# EAGLE design board (EAGLE 9.4.2)

## Sheet 1 of 5
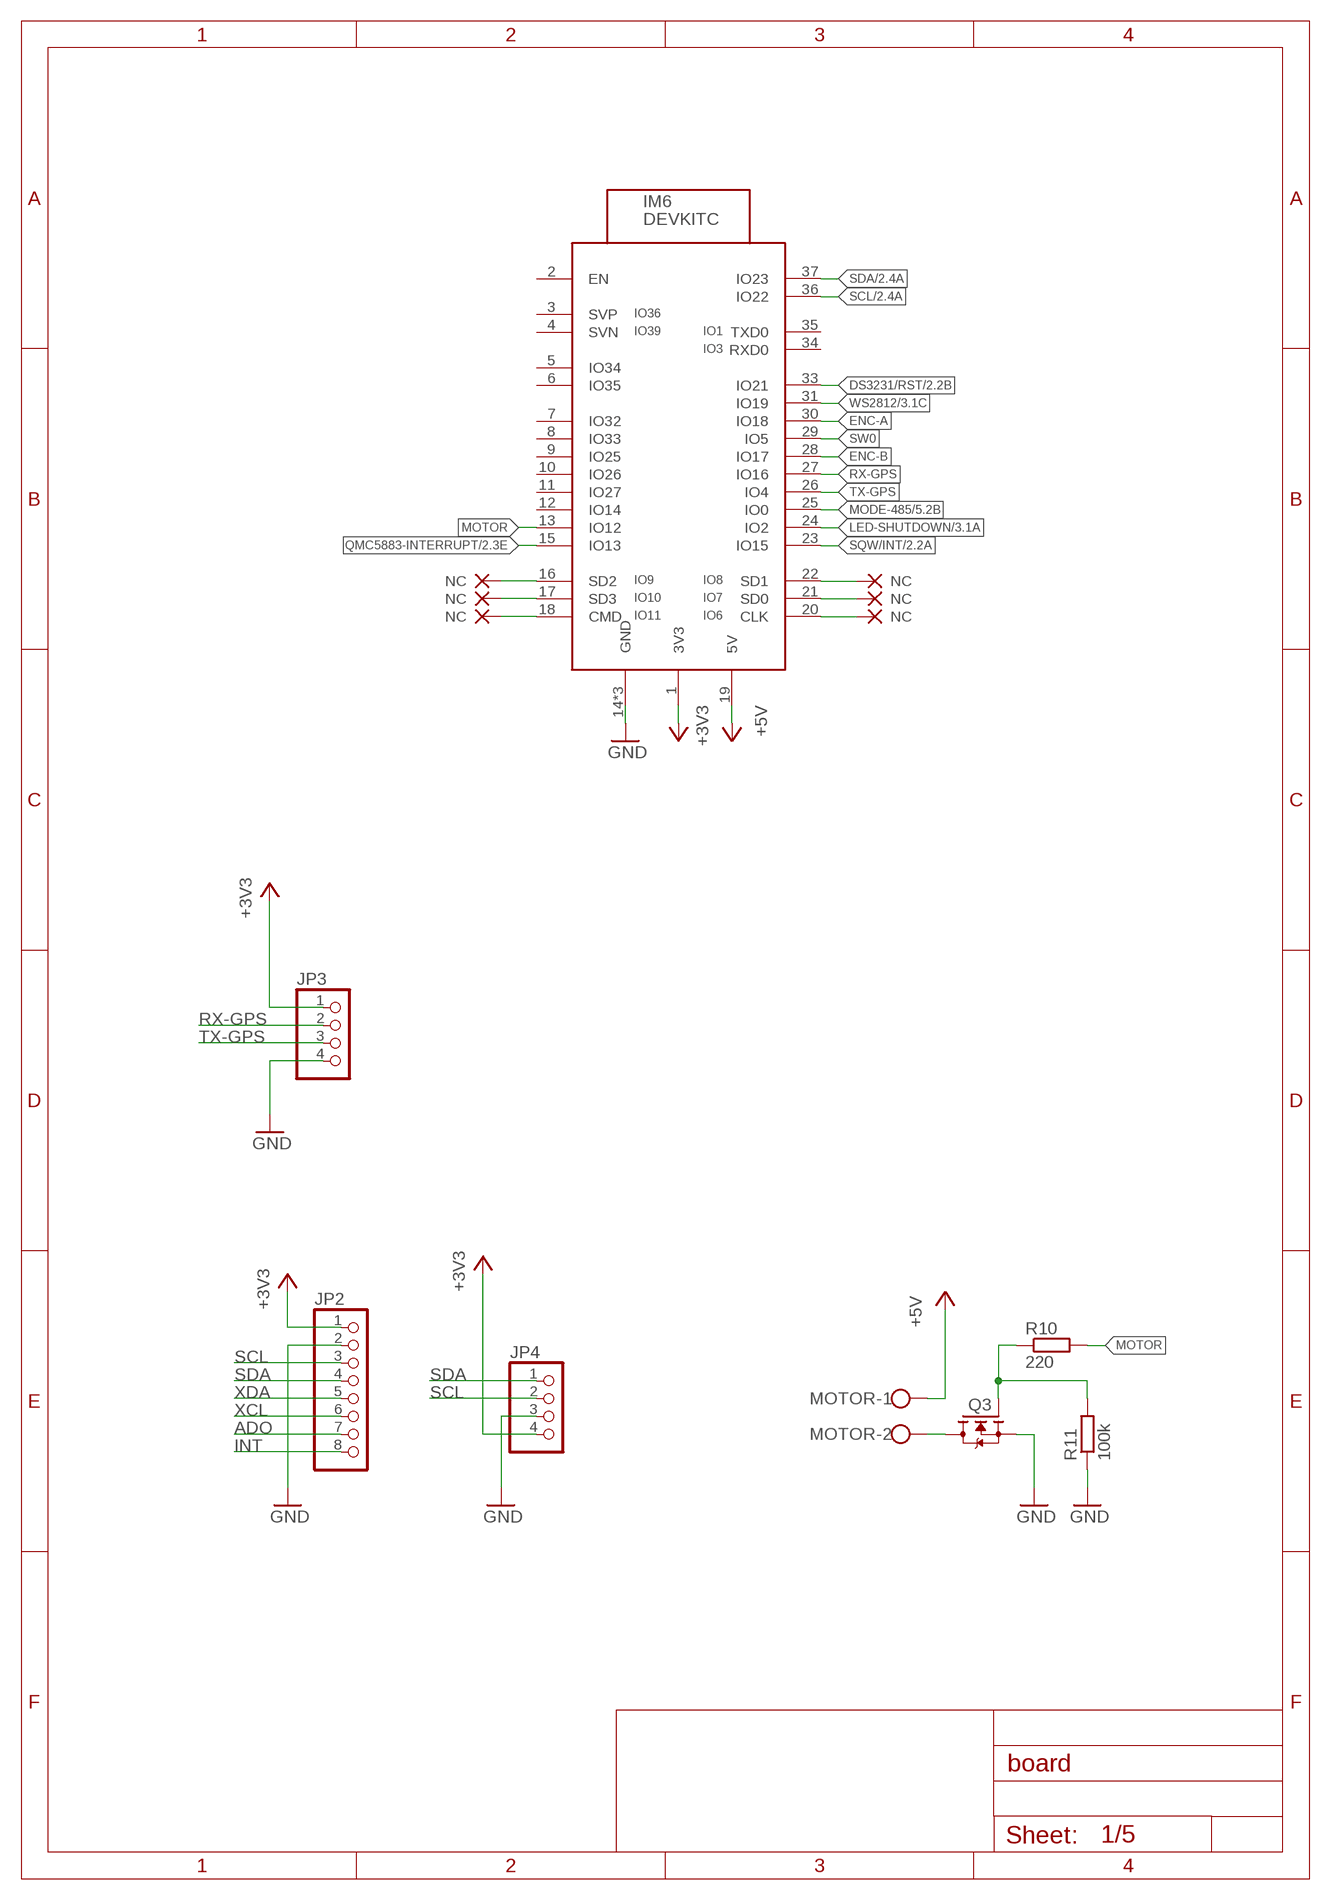
[diagram p0: schematic, sheet 1]

### Parts
IM6  DEVKITC  [DEVKITC]
JP2  PINHD-1X8  [1X08]
JP3  PINHD-1X4  [1X04]
JP4  PINHD-1X4  [1X04]
MOTOR  W237-102  [W237-102]
NC1  NC  (no package)
NC2  NC  (no package)
NC3  NC  (no package)
NC4  NC  (no package)
NC5  NC  (no package)
NC6  NC  (no package)
Q3  N-MOSFET-SO8  [SO-8]
R10  220  R-EU_R0402  [R0402]
R11  100k  R-EU_R0402  [R0402]

### Nets
+3V3: IM6.1(3V3) JP2.1 JP3.1 JP4.4 ; also sheet 2,3
+5V: MOTOR.1 ; also sheet 2,3,5
+5V_ESP: IM6.19(5V) ; supply symbol labelled +5V
ADO: JP2.7
DS3231/RST: IM6.33(IO21) ; also sheet 2
ENC-A: IM6.30(IO18) ; also sheet 2
ENC-B: IM6.28(IO17) ; also sheet 2
GND: IM6.14(GND) IM6.32(GND) IM6.38(GND) JP2.2 JP3.4 JP4.3 R11.1 ; also sheet 2,3,4,5
INT: JP2.8 ; also sheet 2
IO9_NC: IM6.16(SD2) NC1.NC
IO9_NC1: IM6.20(CLK) NC4.NC
IO10_NC: IM6.17(SD3) NC2.NC
IO10_NC1: IM6.21(SD0) NC5.NC
IO11_NC: IM6.18(CMD) NC3.NC
IO11_NC1: IM6.22(SD1) NC6.NC
LED-SHUTDOWN: IM6.24(IO2) ; also sheet 3
MODE-485: IM6.25(IO0) ; also sheet 5
MOTOR: IM6.13(IO12) R10.2
N$70: MOTOR.2 Q3.5(D) Q3.6(D) Q3.7(D) Q3.8(D)
N$71: Q3.4(G) R10.1 R11.2
N$74: Q3.1(S) Q3.2(S) Q3.3(S) ; supply symbol labelled GND
QMC5883-INTERRUPT: IM6.15(IO13) ; also sheet 2
RX-GPS: IM6.27(IO16) JP3.2
SCL: IM6.36(IO22) JP2.3 JP4.2 ; also sheet 2
SDA: IM6.37(IO23) JP2.4 JP4.1 ; also sheet 2
SQW/INT: IM6.23(IO15) ; also sheet 2
SW0: IM6.29(IO5) ; also sheet 2
TX-GPS: IM6.26(IO4) JP3.3
WS2812: IM6.31(IO19) ; also sheet 3
XCL: JP2.6
XDA: JP2.5
Unconnected: IM6.2(EN) IM6.3(SVP) IM6.4(SVN) IM6.5(IO34) IM6.6(IO35) IM6.7(IO32) IM6.8(IO33) IM6.9(IO25) IM6.10(IO26) IM6.11(IO27) IM6.12(IO14) IM6.34(RXD0) IM6.35(TXD0)

## Sheet 2 of 5
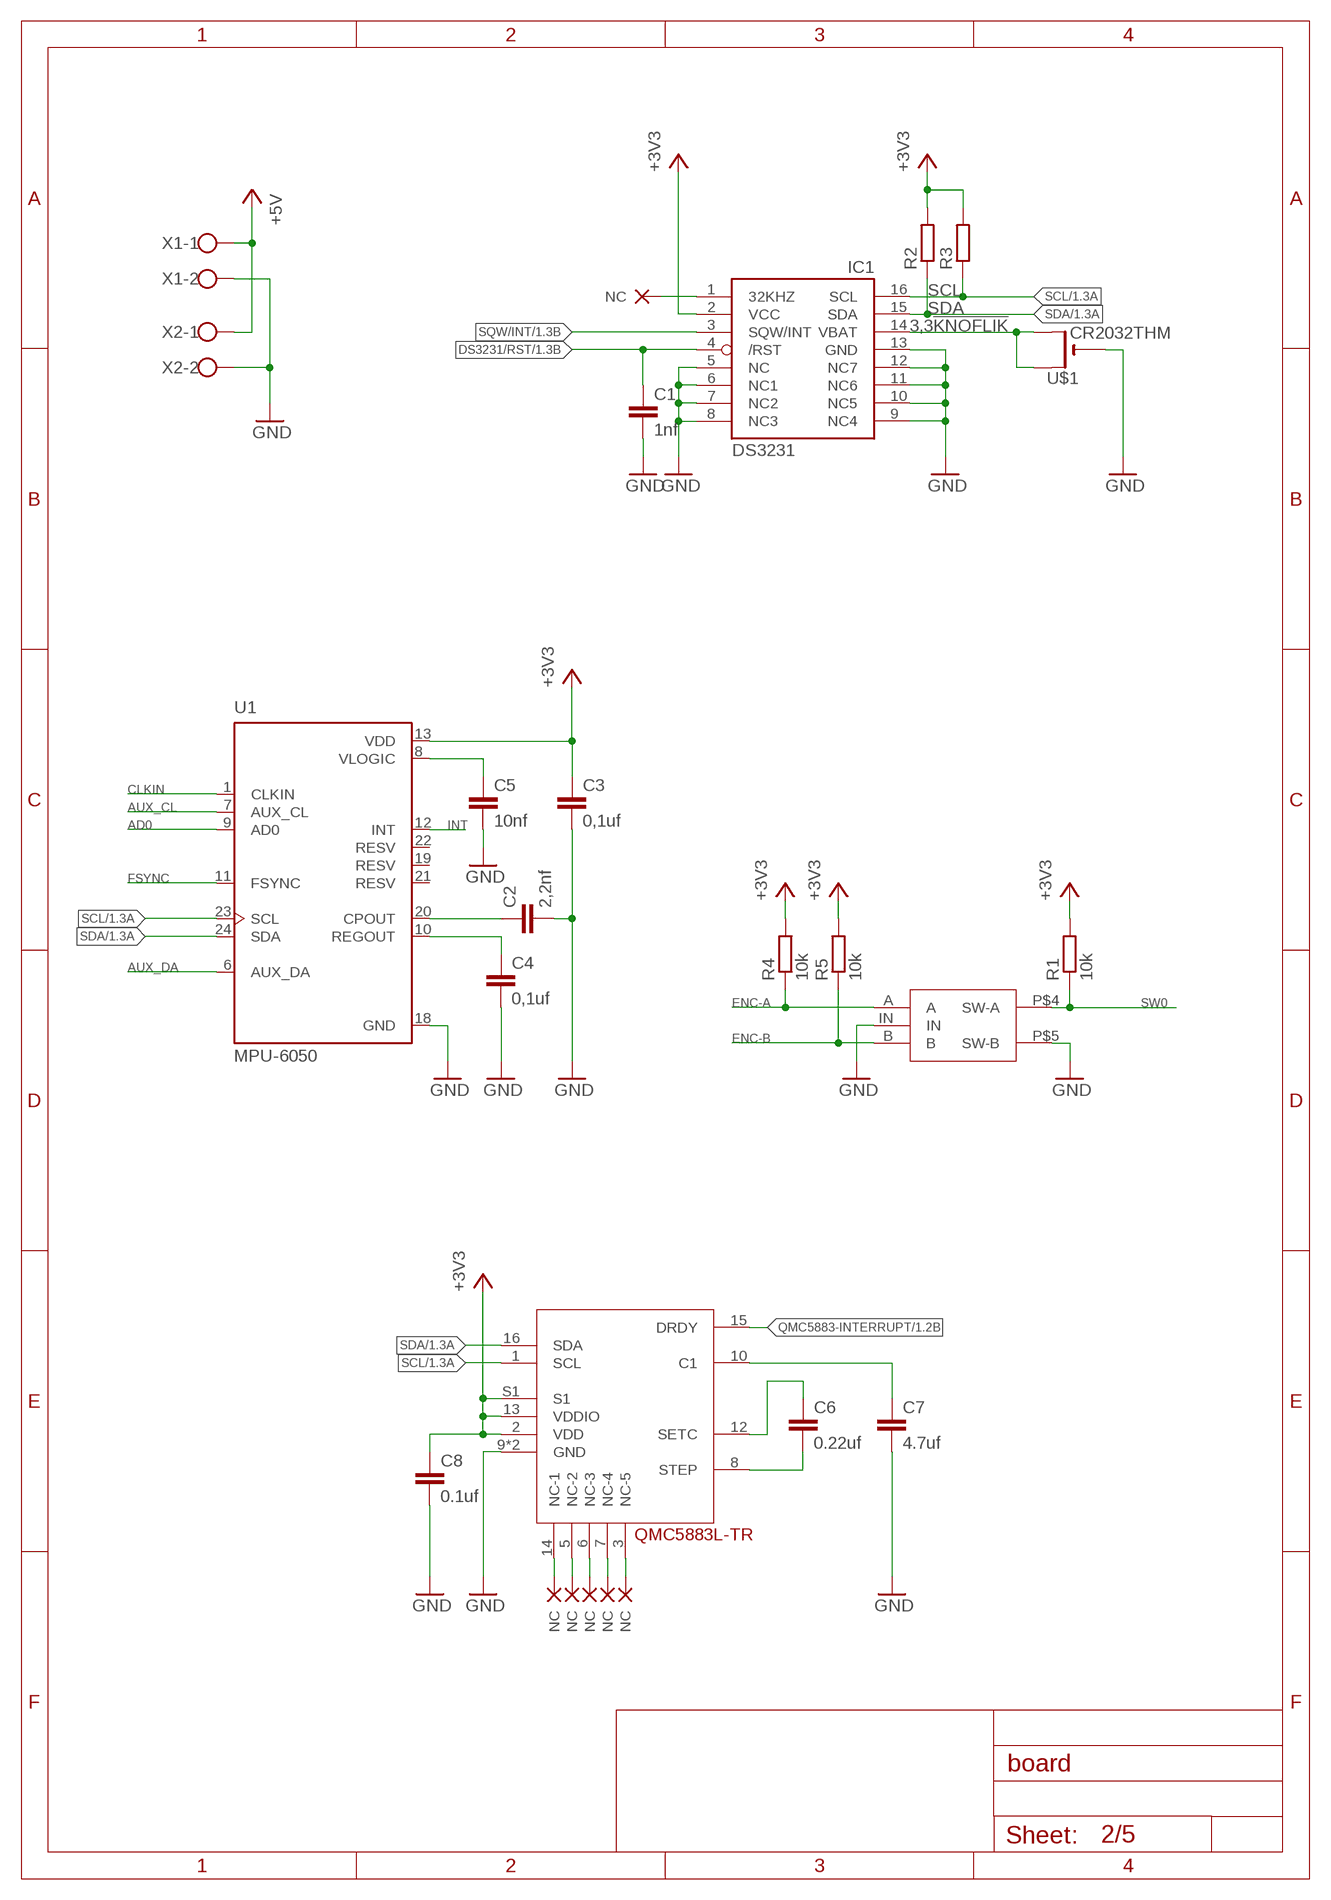
[diagram p1: schematic, sheet 2]

### Parts
C1  1nf  C-EUC0402K  [C0402K]
C2  2,2nf  C-EUC0402K  [C0402K]
C3  0,1uf  C-EUC0402K  [C0402K]
C4  0,1uf  C-EUC0402K  [C0402K]
C5  10nf  C-EUC0402K  [C0402K]
C6  0.22uf  C-EUC0402K  [C0402K]
C7  4.7uf  C-EUC0402K  [C0402K]
C8  0.1uf  C-EUC0402K  [C0402K]
IC1  DS3231/SO  [SO16W]
IC2  QMC5883L-TR  [QMC5882L-TR]
NC7  NC  (no package)
NC8  NC  (no package)
NC9  NC  (no package)
NC10  NC  (no package)
NC11  NC  (no package)
NC12  NC  (no package)
R1  10k  R-EU_R0402  [R0402]
R2  R-EU_R0603  [R0603]
R3  R-EU_R0603  [R0603]
R4  10k  R-EU_R0402  [R0402]
R5  10k  R-EU_R0402  [R0402]
U1  MPU-6050  [QFN50P400X400X95-24N]
U$1  CR2032THM  [CR2032-THRU]
U$62  EC11-1S  [EC11-1S]
X1  W237-102  [W237-102]
X2  W237-102  [W237-102]

### Nets
3,3!KNOFLIK: IC1.14(VBAT) U$1.+1(+) U$1.+2(+1)
+3V3: C3.1 C8.1 IC1.2(VCC) IC2.2(VDD) IC2.13(VDDIO) IC2.S1 R1.2 R2.2 R3.2 R4.2 R5.2 U1.13(VDD) ; also sheet 1,3
+5V: X1.1 X2.1 ; also sheet 1,3,5
AD0: U1.9(AD0)
AUX_CL: U1.7(AUX_CL)
AUX_DA: U1.6(AUX_DA)
CLKIN: U1.1(CLKIN)
DS3231/RST: C1.1 IC1.4(/RST) ; also sheet 1
ENC-A: R4.1 U$62.A ; also sheet 1
ENC-B: R5.1 U$62.B ; also sheet 1
FSYNC: U1.11(FSYNC)
GND: C1.2 C2.2 C3.2 C5.2 C7.2 C8.2 IC1.5(NC) IC1.6(NC1) IC1.7(NC2) IC1.8(NC3) IC1.9(NC4) IC1.10(NC5) IC1.11(NC6) IC1.12(NC7) IC1.13(GND) IC2.9(GND) IC2.11(GND) U1.18(GND) U$1.- U$62.IN U$62.P$5(SW-B) X1.2 X2.2 ; also sheet 1,3,4,5
INT: U1.12(INT) ; also sheet 1
IO9_NC2: IC2.14(NC-1) NC7.NC
IO9_NC3: IC2.7(NC-4) NC11.NC
IO10_NC2: IC2.5(NC-2) NC9.NC
IO10_NC3: IC2.3(NC-5) NC12.NC
IO11_NC2: IC2.6(NC-3) NC10.NC
IO11_NC3: IC1.1(32KHZ) NC8.NC
N$1: C2.1 U1.20(CPOUT)
N$3: C4.1 U1.10(REGOUT)
N$57: C4.2 ; supply symbol labelled GND
N$58: C5.1 U1.8(VLOGIC)
N$60: C6.1 IC2.12(SETC)
N$62: C6.2 IC2.8(STEP)
N$66: C7.1 IC2.10(C1)
QMC5883-INTERRUPT: IC2.15(DRDY) ; also sheet 1
SCL: IC1.16(SCL) IC2.1(SCL) R3.1 U1.23(SCL) ; also sheet 1
SDA: IC1.15(SDA) IC2.16(SDA) R2.1 U1.24(SDA) ; also sheet 1
SQW/INT: IC1.3(SQW/INT) ; also sheet 1
SW0: R1.1 U$62.P$4(SW-A) ; also sheet 1
Unconnected: U1.19(RESV) U1.21(RESV) U1.22(RESV)

## Sheet 3 of 5
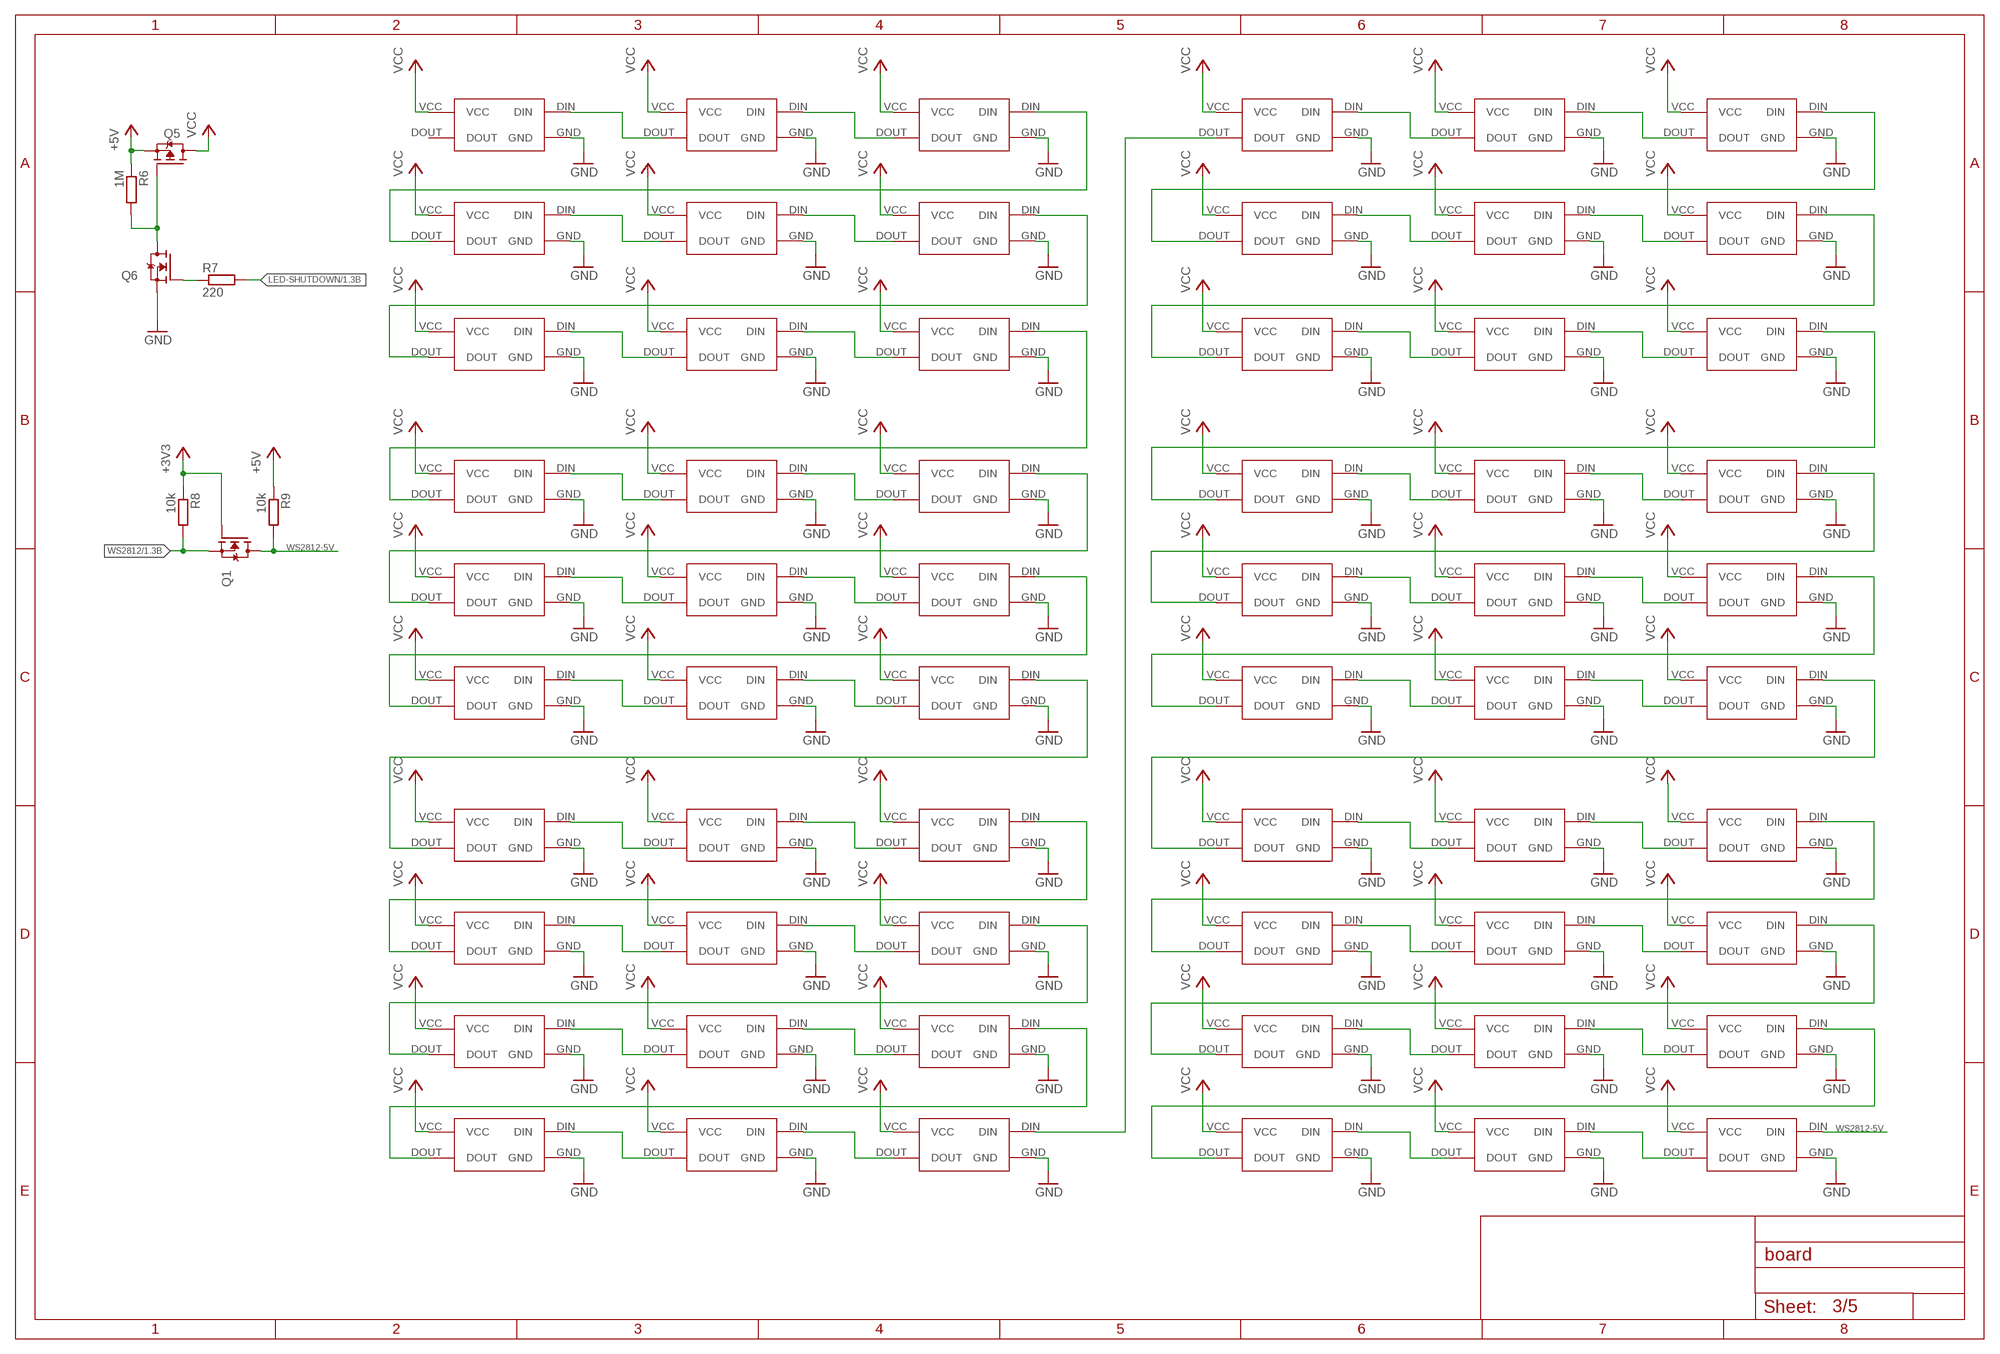
[diagram p2: schematic, sheet 3]

### Parts
Q1  N-MOSFET-SOT23-GSD  [SOT23]
Q5  P-MOSFET-MLP  [MLP3.3X3.3]
Q6  N-MOSFET-SOT23-GSD  [SOT23]
R6  1M  R-EU_R0402  [R0402]
R7  220  R-EU_R0603  [R0603]
R8  10k  R-EU_R0402  [R0402]
R9  10k  R-EU_R0402  [R0402]
U$2  WS2812  [WS2812B-MINI]
U$3  WS2812  [WS2812B-MINI]
U$4  WS2812  [WS2812B-MINI]
U$5  WS2812  [WS2812B-MINI]
U$6  WS2812  [WS2812B-MINI]
U$7  WS2812  [WS2812B-MINI]
U$8  WS2812  [WS2812B-MINI]
U$9  WS2812  [WS2812B-MINI]
U$10  WS2812  [WS2812B-MINI]
U$11  WS2812  [WS2812B-MINI]
U$12  WS2812  [WS2812B-MINI]
U$13  WS2812  [WS2812B-MINI]
U$14  WS2812  [WS2812B-MINI]
U$15  WS2812  [WS2812B-MINI]
U$16  WS2812  [WS2812B-MINI]
U$17  WS2812  [WS2812B-MINI]
U$18  WS2812  [WS2812B-MINI]
U$19  WS2812  [WS2812B-MINI]
U$20  WS2812  [WS2812B-MINI]
U$21  WS2812  [WS2812B-MINI]
U$22  WS2812  [WS2812B-MINI]
U$23  WS2812  [WS2812B-MINI]
U$24  WS2812  [WS2812B-MINI]
U$25  WS2812  [WS2812B-MINI]
U$26  WS2812  [WS2812B-MINI]
U$27  WS2812  [WS2812B-MINI]
U$28  WS2812  [WS2812B-MINI]
U$29  WS2812  [WS2812B-MINI]
U$30  WS2812  [WS2812B-MINI]
U$31  WS2812  [WS2812B-MINI]
U$32  WS2812  [WS2812B-MINI]
U$33  WS2812  [WS2812B-MINI]
U$34  WS2812  [WS2812B-MINI]
U$35  WS2812  [WS2812B-MINI]
U$36  WS2812  [WS2812B-MINI]
U$37  WS2812  [WS2812B-MINI]
U$38  WS2812  [WS2812B-MINI]
U$39  WS2812  [WS2812B-MINI]
U$40  WS2812  [WS2812B-MINI]
U$41  WS2812  [WS2812B-MINI]
U$42  WS2812  [WS2812B-MINI]
U$43  WS2812  [WS2812B-MINI]
U$44  WS2812  [WS2812B-MINI]
U$45  WS2812  [WS2812B-MINI]
U$46  WS2812  [WS2812B-MINI]
U$47  WS2812  [WS2812B-MINI]
U$48  WS2812  [WS2812B-MINI]
U$49  WS2812  [WS2812B-MINI]
U$50  WS2812  [WS2812B-MINI]
U$51  WS2812  [WS2812B-MINI]
U$52  WS2812  [WS2812B-MINI]
U$53  WS2812  [WS2812B-MINI]
U$54  WS2812  [WS2812B-MINI]
U$55  WS2812  [WS2812B-MINI]
U$56  WS2812  [WS2812B-MINI]
U$57  WS2812  [WS2812B-MINI]
U$58  WS2812  [WS2812B-MINI]
U$59  WS2812  [WS2812B-MINI]
U$60  WS2812  [WS2812B-MINI]
U$61  WS2812  [WS2812B-MINI]

### Nets
+3V3: Q1.1(G) R8.1 ; also sheet 1,2
+5V: Q5.1(S) Q5.2(S) Q5.3(S) R6.1 R9.1 ; also sheet 1,2,5
GND: Q6.2(S) U$2.GND U$3.GND U$4.GND U$5.GND U$6.GND U$7.GND U$8.GND U$9.GND U$10.GND U$11.GND U$12.GND U$13.GND U$14.GND U$15.GND U$16.GND U$17.GND U$18.GND U$19.GND U$20.GND U$21.GND U$22.GND U$23.GND U$24.GND U$25.GND U$26.GND U$27.GND U$28.GND U$29.GND U$30.GND U$31.GND U$32.GND U$33.GND U$34.GND U$35.GND U$36.GND U$37.GND U$38.GND U$39.GND U$40.GND U$41.GND U$42.GND U$43.GND U$44.GND U$45.GND U$46.GND U$47.GND U$48.GND U$49.GND U$50.GND U$51.GND U$52.GND U$53.GND U$54.GND U$55.GND U$56.GND U$57.GND U$58.GND U$59.GND U$60.GND U$61.GND ; also sheet 1,2,4,5
LED-SHUTDOWN: R7.2 ; also sheet 1
N$2: U$4.DIN U$5.DOUT
N$4: U$7.DIN U$8.DOUT
N$5: U$2.DIN U$3.DOUT
N$6: U$3.DIN U$4.DOUT
N$7: U$34.DIN U$35.DOUT
N$8: U$5.DIN U$6.DOUT
N$9: U$6.DIN U$7.DOUT
N$10: U$8.DIN U$9.DOUT
N$11: U$9.DIN U$10.DOUT
N$12: U$40.DIN U$41.DOUT
N$13: U$11.DIN U$12.DOUT
N$14: U$12.DIN U$13.DOUT
N$15: U$14.DIN U$15.DOUT
N$16: U$15.DIN U$16.DOUT
N$17: U$46.DIN U$47.DOUT
N$18: U$17.DIN U$18.DOUT
N$19: U$18.DIN U$19.DOUT
N$20: U$20.DIN U$21.DOUT
N$21: U$21.DIN U$22.DOUT
N$22: U$52.DIN U$53.DOUT
N$23: U$23.DIN U$24.DOUT
N$24: U$24.DIN U$25.DOUT
N$25: U$26.DIN U$27.DOUT
N$26: U$27.DIN U$28.DOUT
N$27: U$58.DIN U$59.DOUT
N$28: U$29.DIN U$30.DOUT
N$29: U$30.DIN U$31.DOUT
N$30: U$32.DIN U$33.DOUT
N$31: U$33.DIN U$34.DOUT
N$32: U$10.DIN U$11.DOUT
N$33: U$35.DIN U$36.DOUT
N$34: U$36.DIN U$37.DOUT
N$35: U$38.DIN U$39.DOUT
N$36: U$39.DIN U$40.DOUT
N$37: U$13.DIN U$14.DOUT
N$38: U$41.DIN U$42.DOUT
N$39: U$42.DIN U$43.DOUT
N$40: U$44.DIN U$45.DOUT
N$41: U$45.DIN U$46.DOUT
N$42: U$16.DIN U$17.DOUT
N$43: U$47.DIN U$48.DOUT
N$44: U$48.DIN U$49.DOUT
N$45: U$50.DIN U$51.DOUT
N$46: U$51.DIN U$52.DOUT
N$47: U$49.DIN U$50.DOUT
N$48: U$53.DIN U$54.DOUT
N$49: U$54.DIN U$55.DOUT
N$50: U$56.DIN U$57.DOUT
N$51: U$57.DIN U$58.DOUT
N$52: U$22.DIN U$23.DOUT
N$53: U$59.DIN U$60.DOUT
N$54: U$60.DIN U$61.DOUT
N$55: U$25.DIN U$26.DOUT
N$56: U$28.DIN U$29.DOUT
N$59: U$31.DIN U$32.DOUT
N$61: U$37.DIN U$38.DOUT
N$63: U$43.DIN U$44.DOUT
N$64: U$19.DIN U$20.DOUT
N$65: U$55.DIN U$56.DOUT
N$68: Q5.4(G) Q6.3(D) R6.2
N$69: Q6.1(G) R7.1
VCC: Q5.5(D) Q5.6(D) Q5.7(D) Q5.8(D) U$2.VCC U$3.VCC U$4.VCC U$5.VCC U$6.VCC U$7.VCC U$8.VCC U$9.VCC U$10.VCC U$11.VCC U$12.VCC U$13.VCC U$14.VCC U$15.VCC U$16.VCC U$17.VCC U$18.VCC U$19.VCC U$20.VCC U$21.VCC U$22.VCC U$23.VCC U$24.VCC U$25.VCC U$26.VCC U$27.VCC U$28.VCC U$29.VCC U$30.VCC U$31.VCC U$32.VCC U$33.VCC U$34.VCC U$35.VCC U$36.VCC U$37.VCC U$38.VCC U$39.VCC U$40.VCC U$41.VCC U$42.VCC U$43.VCC U$44.VCC U$45.VCC U$46.VCC U$47.VCC U$48.VCC U$49.VCC U$50.VCC U$51.VCC U$52.VCC U$53.VCC U$54.VCC U$55.VCC U$56.VCC U$57.VCC U$58.VCC U$59.VCC U$60.VCC U$61.VCC ; also sheet 4
WS2812: Q1.2(S) R8.2 ; also sheet 1
WS2812-5V: Q1.3(D) R9.2 U$61.DIN
Unconnected: U$2.DOUT

## Sheet 4 of 5
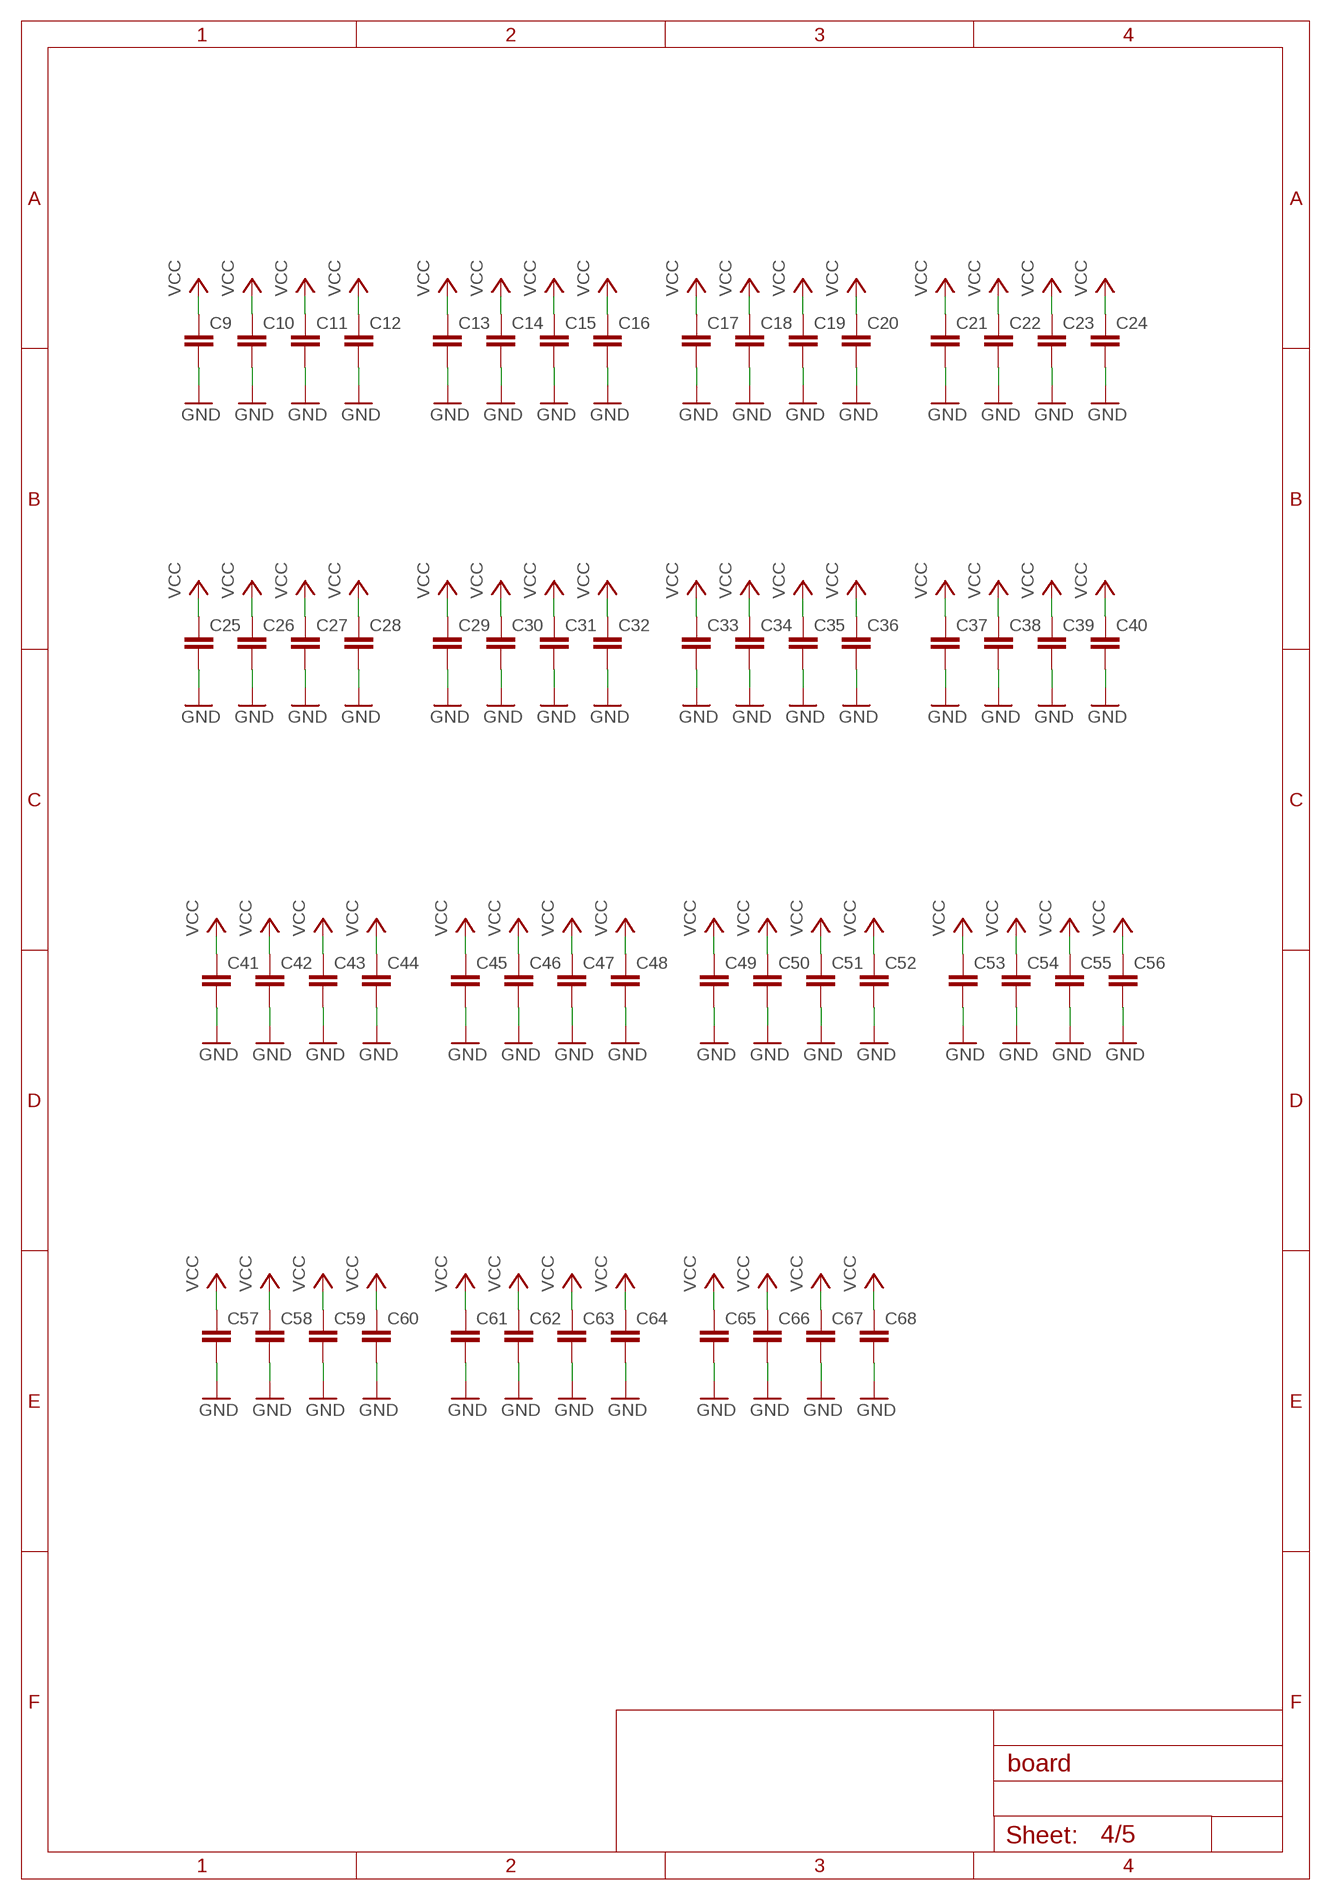
[diagram p3: schematic, sheet 4]

### Parts
C9  C-EUC0402K  [C0402K]
C10  C-EUC0402K  [C0402K]
C11  C-EUC0402K  [C0402K]
C12  C-EUC0402K  [C0402K]
C13  C-EUC0402K  [C0402K]
C14  C-EUC0402K  [C0402K]
C15  C-EUC0402K  [C0402K]
C16  C-EUC0402K  [C0402K]
C17  C-EUC0402K  [C0402K]
C18  C-EUC0402K  [C0402K]
C19  C-EUC0402K  [C0402K]
C20  C-EUC0402K  [C0402K]
C21  C-EUC0402K  [C0402K]
C22  C-EUC0402K  [C0402K]
C23  C-EUC0402K  [C0402K]
C24  C-EUC0402K  [C0402K]
C25  C-EUC0402K  [C0402K]
C26  C-EUC0402K  [C0402K]
C27  C-EUC0402K  [C0402K]
C28  C-EUC0402K  [C0402K]
C29  C-EUC0402K  [C0402K]
C30  C-EUC0402K  [C0402K]
C31  C-EUC0402K  [C0402K]
C32  C-EUC0402K  [C0402K]
C33  C-EUC0402K  [C0402K]
C34  C-EUC0402K  [C0402K]
C35  C-EUC0402K  [C0402K]
C36  C-EUC0402K  [C0402K]
C37  C-EUC0402K  [C0402K]
C38  C-EUC0402K  [C0402K]
C39  C-EUC0402K  [C0402K]
C40  C-EUC0402K  [C0402K]
C41  C-EUC0402K  [C0402K]
C42  C-EUC0402K  [C0402K]
C43  C-EUC0402K  [C0402K]
C44  C-EUC0402K  [C0402K]
C45  C-EUC0402K  [C0402K]
C46  C-EUC0402K  [C0402K]
C47  C-EUC0402K  [C0402K]
C48  C-EUC0402K  [C0402K]
C49  C-EUC0402K  [C0402K]
C50  C-EUC0402K  [C0402K]
C51  C-EUC0402K  [C0402K]
C52  C-EUC0402K  [C0402K]
C53  C-EUC0402K  [C0402K]
C54  C-EUC0402K  [C0402K]
C55  C-EUC0402K  [C0402K]
C56  C-EUC0402K  [C0402K]
C57  C-EUC0402K  [C0402K]
C58  C-EUC0402K  [C0402K]
C59  C-EUC0402K  [C0402K]
C60  C-EUC0402K  [C0402K]
C61  C-EUC0402K  [C0402K]
C62  C-EUC0402K  [C0402K]
C63  C-EUC0402K  [C0402K]
C64  C-EUC0402K  [C0402K]
C65  C-EUC0402K  [C0402K]
C66  C-EUC0402K  [C0402K]
C67  C-EUC0402K  [C0402K]
C68  C-EUC0402K  [C0402K]

### Nets
GND: C9.2 C10.2 C11.2 C12.2 C13.2 C14.2 C15.2 C16.2 C17.2 C18.2 C19.2 C20.2 C21.2 C22.2 C23.2 C24.2 C25.2 C26.2 C27.2 C28.2 C29.2 C30.2 C31.2 C32.2 C33.2 C34.2 C35.2 C36.2 C37.2 C38.2 C39.2 C40.2 C41.2 C42.2 C43.2 C44.2 C45.2 C46.2 C47.2 C48.2 C49.2 C50.2 C51.2 C52.2 C53.2 C54.2 C55.2 C56.2 C57.2 C58.2 C59.2 C60.2 C61.2 C62.2 C63.2 C64.2 C65.2 C66.2 C67.2 C68.2 ; also sheet 1,2,3,5
VCC: C9.1 C10.1 C11.1 C12.1 C13.1 C14.1 C15.1 C16.1 C17.1 C18.1 C19.1 C20.1 C21.1 C22.1 C23.1 C24.1 C25.1 C26.1 C27.1 C28.1 C29.1 C30.1 C31.1 C32.1 C33.1 C34.1 C35.1 C36.1 C37.1 C38.1 C39.1 C40.1 C41.1 C42.1 C43.1 C44.1 C45.1 C46.1 C47.1 C48.1 C49.1 C50.1 C51.1 C52.1 C53.1 C54.1 C55.1 C56.1 C57.1 C58.1 C59.1 C60.1 C61.1 C62.1 C63.1 C64.1 C65.1 C66.1 C67.1 C68.1 ; also sheet 3

## Sheet 5 of 5
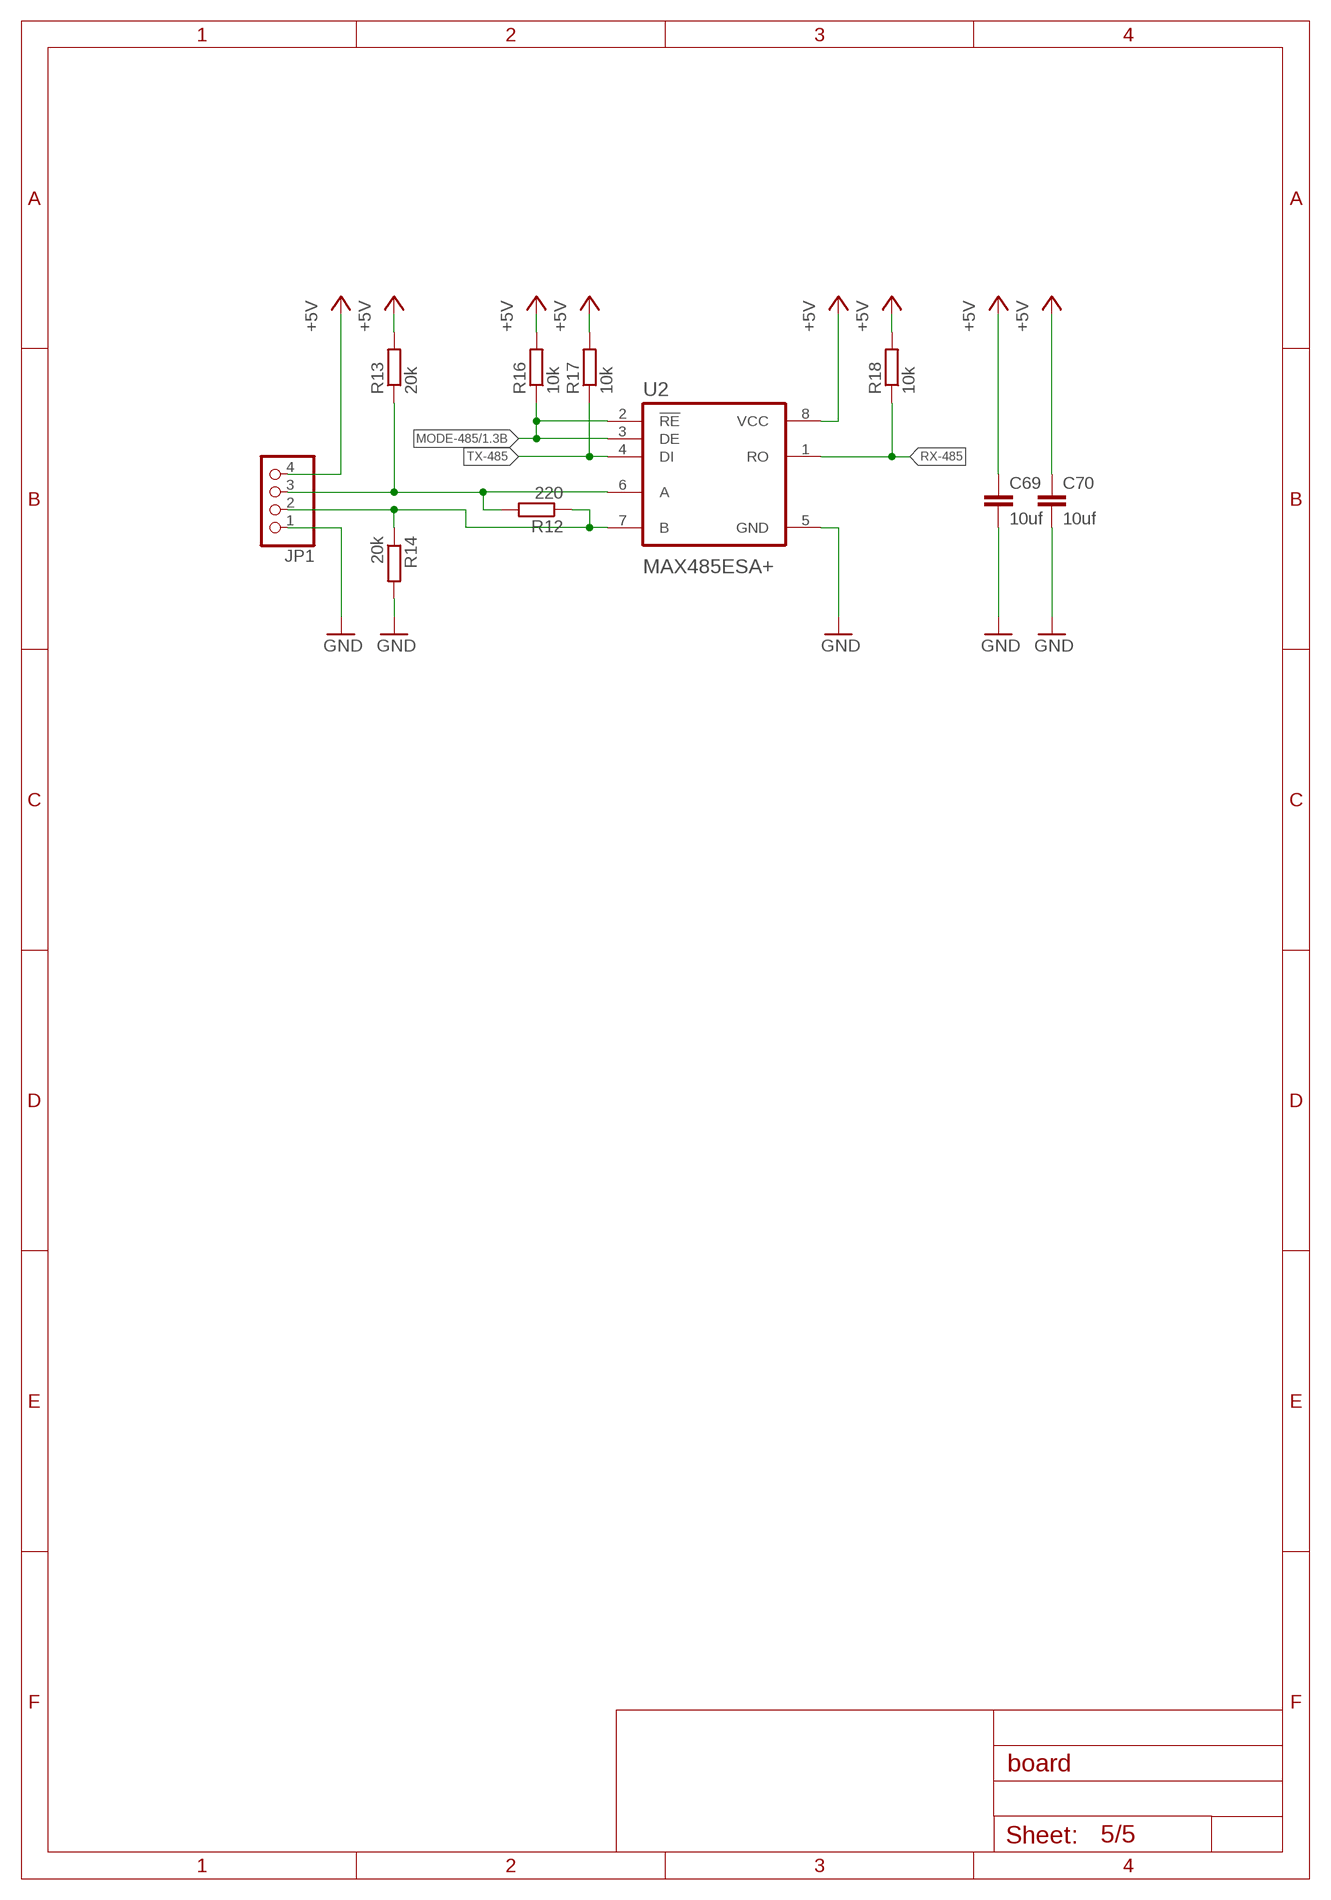
[diagram p4: schematic, sheet 5]

### Parts
C69  10uf  C-EUC0402K  [C0402K]
C70  10uf  C-EUC0402K  [C0402K]
JP1  PINHD-1X4  [1X04]
R12  220  R-EU_R0402  [R0402]
R13  20k  R-EU_R0402  [R0402]
R14  20k  R-EU_R0402  [R0402]
R16  10k  R-EU_R0402  [R0402]
R17  10k  R-EU_R0402  [R0402]
R18  10k  R-EU_R0402  [R0402]
U2  MAX485ESA+  [SOIC127P600X175-8N]

### Nets
+5V: C69.1 C70.1 JP1.4 R13.2 R16.2 R17.2 R18.2 U2.8(VCC) ; also sheet 1,2,3
GND: C69.2 C70.2 JP1.1 R14.2 U2.5(GND) ; also sheet 1,2,3,4
MODE-485: R16.1 U2.2(!RE) U2.3(DE) ; also sheet 1
N$72: JP1.2 R12.1 R14.1 U2.7(B)
N$73: JP1.3 R12.2 R13.1 U2.6(A)
RX-485: R18.1 U2.1(RO)
TX-485: R17.1 U2.4(DI)

## Library data of the parts
C1-C70 = rcl:C-EU: CAPACITOR, European symbol; SPICEPREFIX: C
IC1 = DS3231:DS3231; AVAILABILITY: Unavailable; MF: Maxim Integrated; MP: DS3231; PACKAGE: SOIC-16 Maxim Integrated; PRICE: None
IC2 = QMC5883L-TR:QMC5883L-TR
IM6 = esp32:DEVKITC
JP1 JP3 JP4 = pinhead:PINHD-1X4: PIN HEADER
JP2 = pinhead:PINHD-1X8: PIN HEADER
MOTOR X1 X2 = con-wago-500:W237-102: WAGO SCREW CLAMP; MPN: 237-102; OC_FARNELL: unknown; OC_NEWARK: 70K9898
NC1-NC12 = NC:NC: _EXTERNAL_
Q1 Q3 Q6 = transistors:N-MOSFET
Q5 = transistors:P-MOSFET
R1-R14 R16-R18 = rcl:R-EU_: RESISTOR, European symbol; SPICEPREFIX: R
U1 = MPU-6050:MPU-6050: MPU-6050 Six-Axis (Gyro + Accelerometer) MEMS MotionTracking™ Devices; AVAILABILITY: Unavailable; DESCRIPTION: 3-axis gyroscope, 3-axis accelerometer in a 4x4x0.9 housing; MF: TDK InvenSense; MP: MPU-6050; PACKAGE: QFN-24 InvenSense; PRICE: None
U2 = MAX485ESA_:MAX485ESA+; AVAILABILITY: Unavailable; DESCRIPTION: Single Transmitter/Receiver RS-422/RS-485 8-Pin SOIC N; MF: Maxim Integrated; MP: MAX485ESA+; PACKAGE: SOIC-8 Maxim; PRICE: None
U$1 = CR2032:CR2032; AVAILABILITY: Unavailable; DESCRIPTION: Battery, LITHIUM High Energy, 3 Volts, 230 mAh, Coin Cell; MF: FDK America,; MP: CR2032; PACKAGE: FDK; PRICE: None
U$2-U$61 = WS2812:WS2812
U$62 = EC11-1S:EC11-1S

## Net classes
0 default: width 0.2 mm, drill 0.35 mm, clearance 0.2 mm

## Board
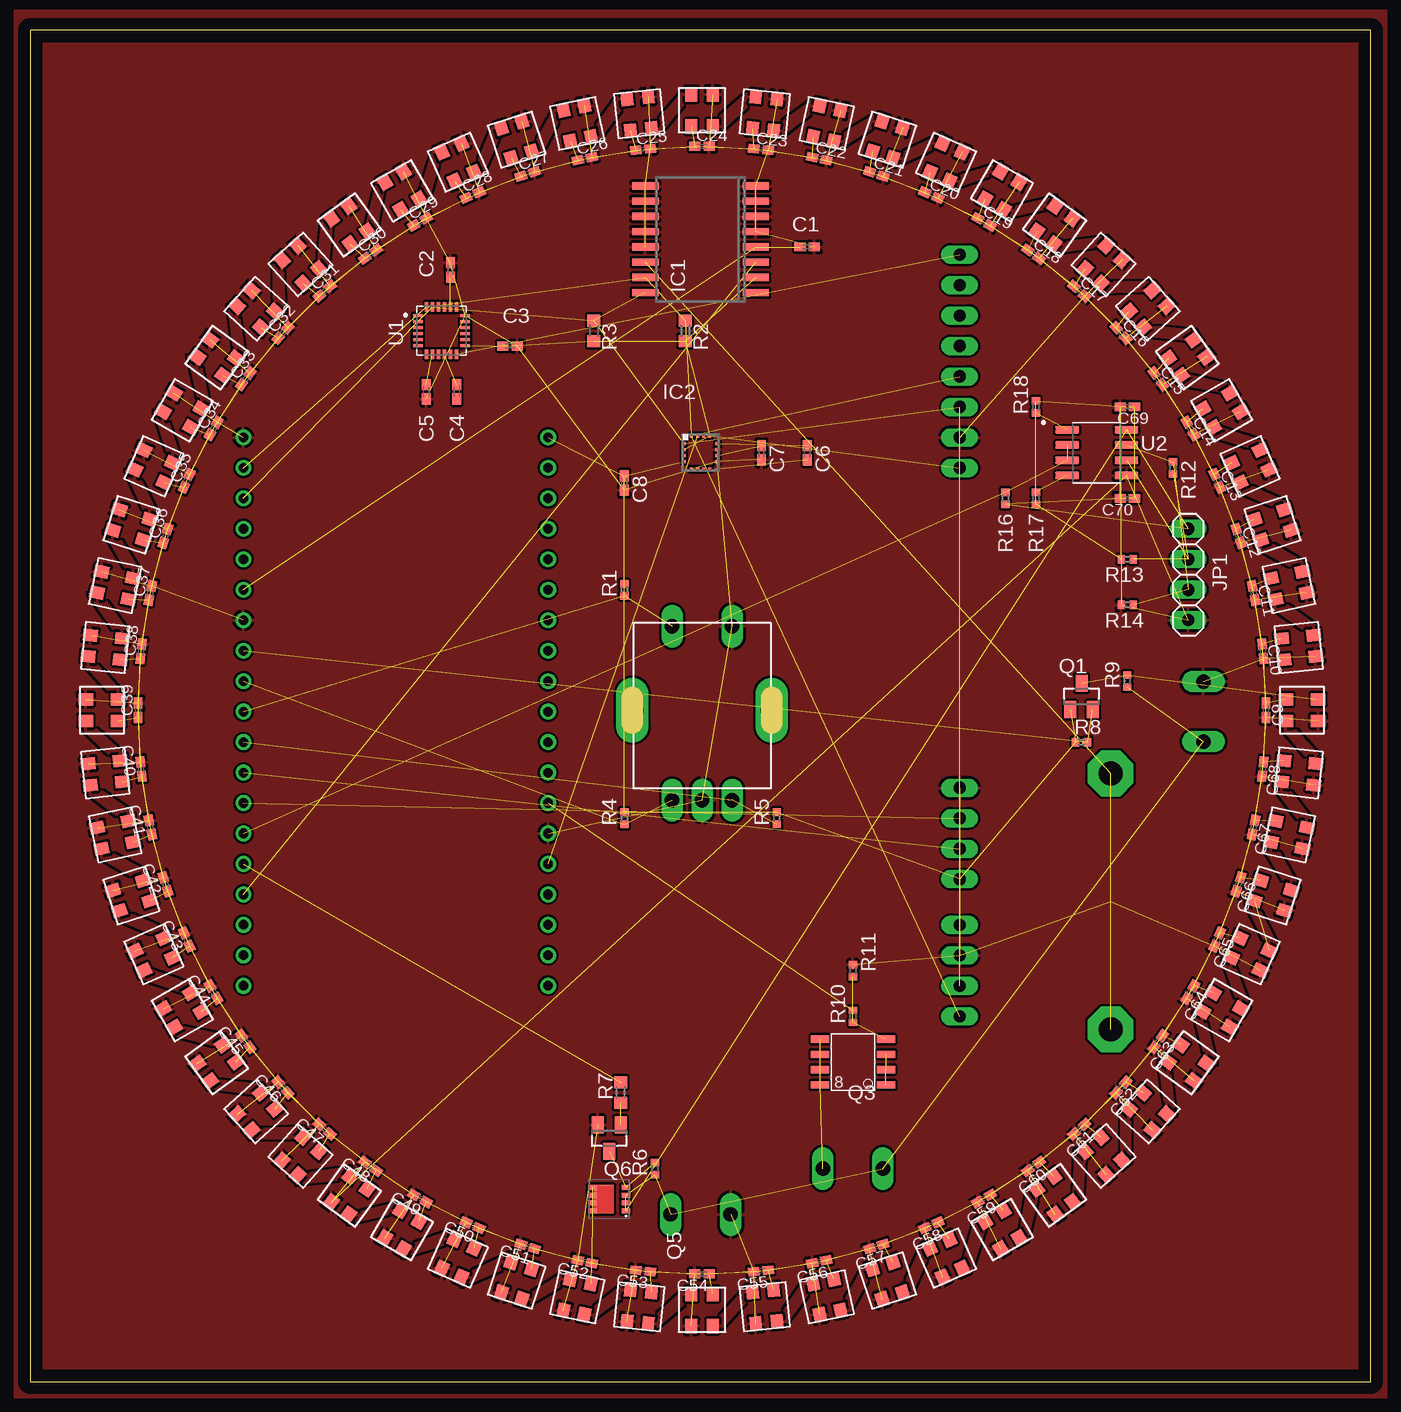
[diagram p5: board, top side]
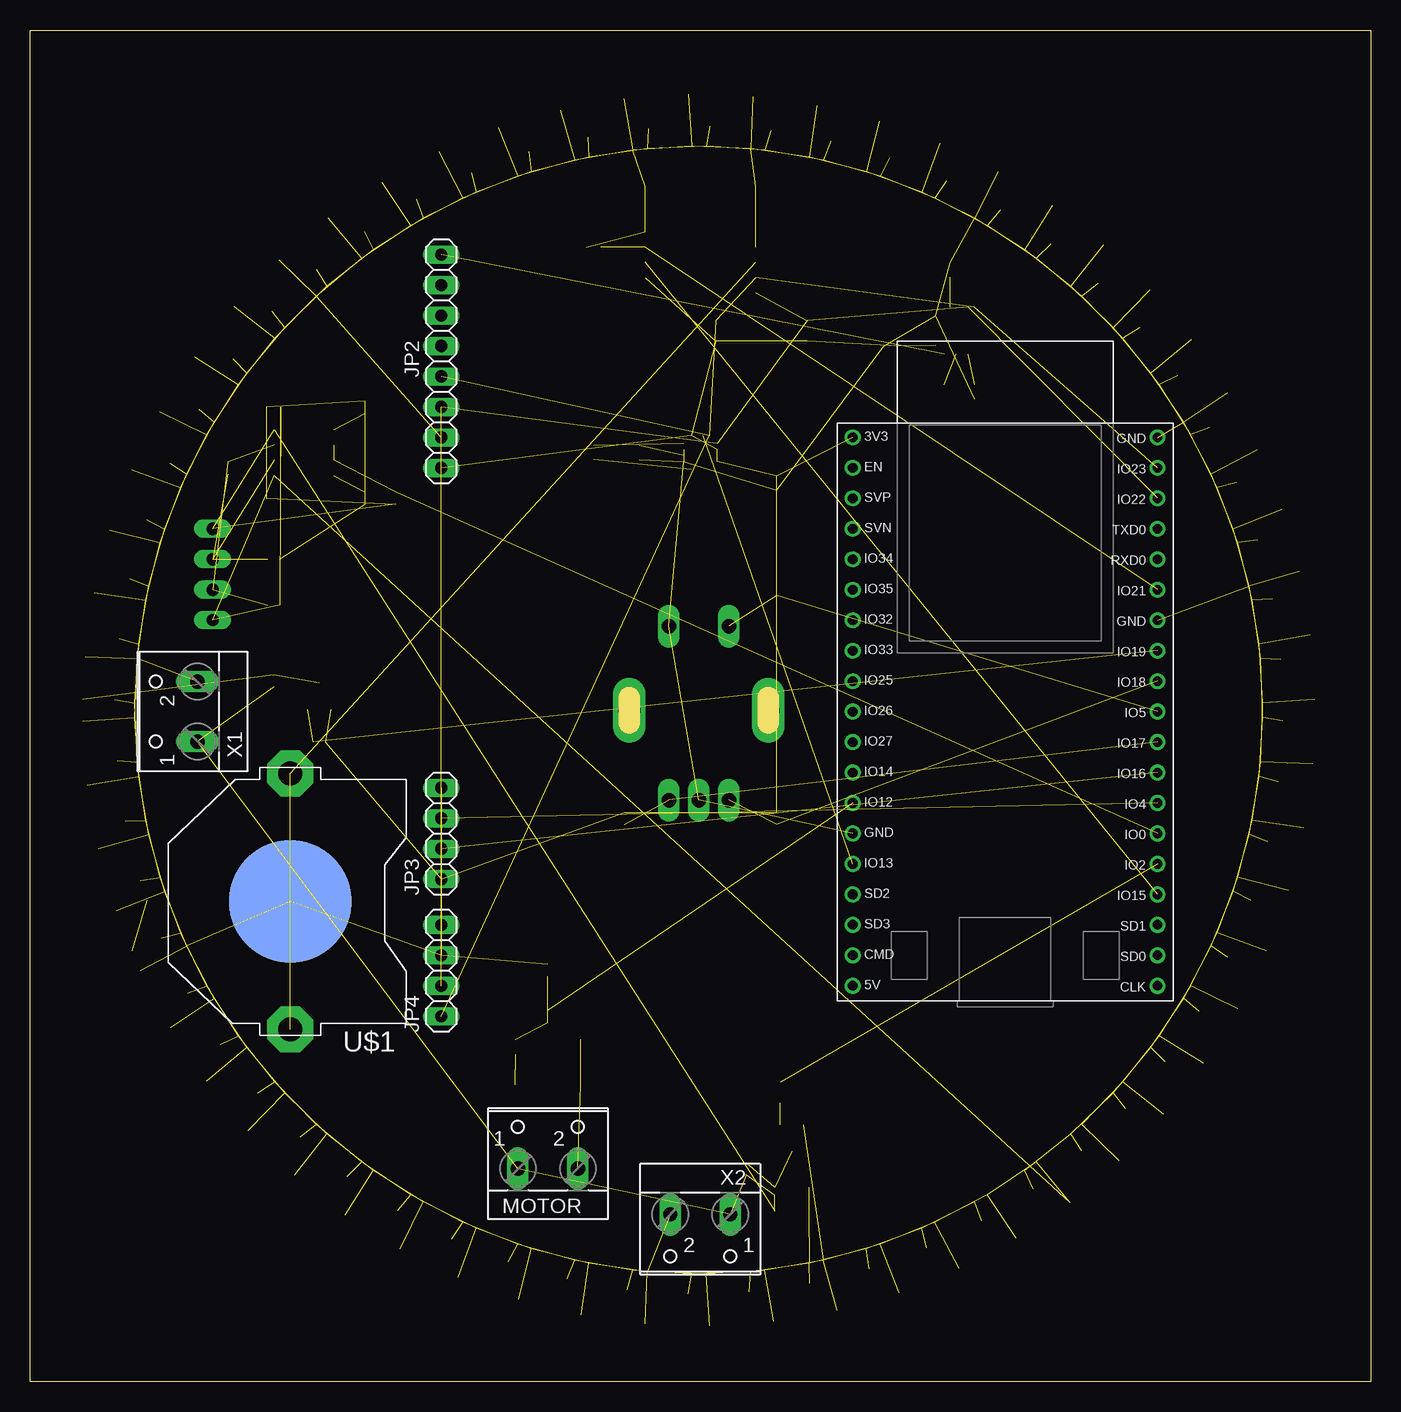
[diagram p6: board, bottom side, seen from below]

Size 111.74 x 112.7 mm. Coordinates in mm from the lower left corner, seen from the top.
Outline: 0,0 111.74,0 111.74,112.7 0,112.7 0,0
Copper layers (1*16): Top 0.035mm / dielectric 1.5mm / Bottom 0.035mm
Design rules "default": minimum track width 6mil, minimum drill 0.35mm, track to track 6mil, track to pad 6mil, pad to pad 6mil, via to via 6mil, smd to smd 6mil, copper to edge 40mil, drill to drill 6mil, minimum pad ring 10mil, minimum via ring 8mil, stop-mask expansion 4mil, vias tented up to drill 0mil, thermal gap 10mil

### Footprints (pad centres in the part's own frame; a part is rotated, then mirrored left to right if it is on the bottom)
C0402K = smd 0.925 x 0.74: 1 -0.6,0; 2 0.6,0
SO16W = smd 0.6 x 2.2: 1 -4.445,-4.6; 2 -3.175,-4.6; 3 -1.905,-4.6; 4 -0.635,-4.6; 5 0.635,-4.6; 6 1.905,-4.6; 7 3.175,-4.6; 8 4.445,-4.6; 9 4.445,4.6; 10 3.175,4.6; 11 1.905,4.6; 12 0.635,4.6; 13 -0.635,4.6; 14 -1.905,4.6; 15 -3.175,4.6; 16 -4.445,4.6
QMC5882L-TR = smd 0.325 x 0.25: 1 -1.397,0.762; 2 -1.397,0.254; 3 -1.397,-0.254; 9 1.397,-0.762; 10 1.397,-0.254; 11 1.397,0.254; 12 1.397,0.762; S1 -1.397,-0.762 | smd 0.25 x 0.325: 5 -0.762,-1.397; 6 -0.254,-1.397; 7 0.254,-1.397; 8 0.762,-1.397; 13 0.762,1.397; 14 0.254,1.397; 15 -0.254,1.397; 16 -0.762,1.397
DEVKITC = drill 0.8: 1 -12.7,46.99; 2 -12.7,44.45; 3 -12.7,41.91; 4 -12.7,39.37; 5 -12.7,36.83; 6 -12.7,34.29; 7 -12.7,31.75; 8 -12.7,29.21; 9 -12.7,26.67; 10 -12.7,24.13; 11 -12.7,21.59; 12 -12.7,19.05; 13 -12.7,16.51; 14 -12.7,13.97; 15 -12.7,11.43; 16 -12.7,8.89; 17 -12.7,6.35; 18 -12.7,3.81; 19 -12.7,1.27; 20 12.7,1.27; 21 12.7,3.81; 22 12.7,6.35; 23 12.7,8.89; 24 12.7,11.43; 25 12.7,13.97; 26 12.7,16.51; 27 12.7,19.05; 28 12.7,21.59; 29 12.7,24.13; 30 12.7,26.67; 31 12.7,29.21; 32 12.7,31.75; 33 12.7,34.29; 34 12.7,36.83; 35 12.7,39.37; 36 12.7,41.91; 37 12.7,44.45; 38 12.7,46.99
1X04 = drill 1.016 long: 1 -3.81,0; 2 -1.27,0; 3 1.27,0; 4 3.81,0
1X08 = drill 1.016 long: 1 -8.89,0; 2 -6.35,0; 3 -3.81,0; 4 -1.27,0; 5 1.27,0; 6 3.81,0; 7 6.35,0; 8 8.89,0
W237-102 = drill 1.194 long: 1 -2.5,-1.27; 2 2.5,-1.27
SOT23 = smd 1 x 1.4: 1 -0.95,-1.1; 2 0.95,-1.1; 3 0,1.1
SO-8 = smd 1.524 x 0.61: 1 -2.743,1.905; 2 -2.743,0.635; 3 -2.743,-0.635; 4 -2.743,-1.905; 5 2.743,-1.905; 6 2.743,-0.635; 7 2.743,0.635; 8 2.743,1.905
MLP3.3X3.3 = smd 0.42 x 0.7: 1 -0.975,-1.4; 2 -0.325,-1.4; 3 0.325,-1.4; 4 0.975,-1.4; 5 0.975,1.4; 6 0.325,1.4; 7 -0.325,1.4; 8 -0.975,1.4
R0402 = smd 0.6 x 0.7: 1 -0.5,0; 2 0.5,0
R0603 = smd 1 x 1.1: 1 -0.85,0; 2 0.85,0
QFN50P400X400X95-24N = smd 0.79 x 0.26: 1 -1.97,1.25; 2 -1.97,0.75; 3 -1.97,0.25; 4 -1.97,-0.25; 5 -1.97,-0.75; 6 -1.97,-1.25; 13 1.97,-1.25; 14 1.97,-0.75; 15 1.97,-0.25; 16 1.97,0.25; 17 1.97,0.75; 18 1.97,1.25 | smd 0.26 x 0.79: 7 -1.25,-1.97; 8 -0.75,-1.97; 9 -0.25,-1.97; 10 0.25,-1.97; 11 0.75,-1.97; 12 1.25,-1.97; 19 1.25,1.97; 20 0.75,1.97; 21 0.25,1.97; 22 -0.25,1.97; 23 -0.75,1.97; 24 -1.25,1.97
SOIC127P600X175-8N = smd 1.97 x 0.59: 1 -2.475,1.905; 2 -2.475,0.635; 3 -2.475,-0.635; 4 -2.475,-1.905; 5 2.475,-1.905; 6 2.475,-0.635; 7 2.475,0.635; 8 2.475,1.905
CR2032-THRU = drill 2 pad 3.81 octagon: +1 -10.668,0; +2 10.668,0 | smd 10.16 x 10.16: - 0,0
WS2812B-MINI = smd 1.2 x 1: DIN 1.34,0.89; DOUT -1.34,-0.89; GND 1.34,-0.89; VCC -1.34,0.89
EC11-1S = drill 1.2 long: A -7.5,2.5; B -7.5,-2.5; IN -7.5,0; P$4 7,2.5; P$5 7,-2.5 | drill 1.8 long: P$1 0,-5.8; P$2 0,5.8

### Placement (x,y rotation side)
C1  64.77,94.61 0 top
C2  35.04,92.71 90 top
C3  40.01,86.36 0 top
C4  35.56,82.55 270 top
C5  33.02,82.55 270 top
C6  64.77,77.47 270 top
C7  60.96,77.47 270 top
C8  49.53,74.93 270 top
C9  103,56 270 top
C10  102.74,60.91 276 top
C11  101.97,65.77 282 top
C12  100.7,70.52 288 top
C13  98.94,75.12 294 top
C14  96.7,79.5 300 top
C15  94.02,83.63 306 top
C16  90.93,87.45 312 top
C17  87.45,90.93 318 top
C18  83.63,94.02 324 top
C19  79.5,96.7 330 top
C20  75.12,98.94 336 top
C21  70.52,100.7 342 top
C22  65.77,101.97 348 top
C23  60.91,102.74 354 top
C24  56,103 0 top
C25  51.09,102.74 6 top
C26  46.23,101.97 12 top
C27  41.48,100.7 18 top
C28  36.88,98.94 24 top
C29  32.5,96.7 30 top
C30  28.37,94.02 36 top
C31  24.55,90.93 42 top
C32  21.07,87.45 48 top
C33  17.98,83.63 54 top
C34  15.3,79.5 60 top
C35  13.06,75.12 66 top
C36  11.3,70.52 72 top
C37  10.03,65.77 78 top
C38  9.26,60.91 84 top
C39  9,56 90 top
C40  9.26,51.09 96 top
C41  10.03,46.23 102 top
C42  11.3,41.48 108 top
C43  13.06,36.88 114 top
C44  15.3,32.5 120 top
C45  17.98,28.37 126 top
C46  21.07,24.55 132 top
C47  24.55,21.07 138 top
C48  28.37,17.98 144 top
C49  32.5,15.3 150 top
C50  36.88,13.06 156 top
C51  41.48,11.3 162 top
C52  46.23,10.03 168 top
C53  51.09,9.26 174 top
C54  56,9 180 top
C55  60.91,9.26 186 top
C56  65.77,10.03 192 top
C57  70.52,11.3 198 top
C58  75.12,13.06 204 top
C59  79.5,15.3 210 top
C60  83.63,17.98 216 top
C61  87.45,21.07 222 top
C62  90.93,24.55 228 top
C63  94.02,28.37 234 top
C64  96.7,32.5 240 top
C65  98.94,36.88 246 top
C66  100.7,41.48 252 top
C67  101.97,46.23 258 top
C68  102.74,51.09 264 top
C69  91.44,81.28 180 top
C70  91.44,73.66 180 top
IC1  55.88,95.25 90 top
IC2  55.88,77.47 0 top
IM6  30.48,31.75 0 bottom
JP1  96.52,67.31 90 top
JP2  77.47,85.09 90 bottom
JP3  77.47,45.72 90 bottom
JP4  77.47,34.29 90 bottom
MOTOR  68.58,19.05 0 bottom
Q1  87.63,57.15 0 top
Q3  68.58,26.67 180 top
Q5  48.26,15.24 90 top
Q6  48.26,20.32 180 top
R1  49.53,66.04 90 top
R2  54.61,87.63 270 top
R3  46.99,87.63 270 top
R4  49.53,46.99 90 top
R5  62.23,46.99 90 top
R6  52.07,17.78 90 top
R7  49.22,24.13 90 top
R8  87.63,53.34 0 top
R9  91.44,58.42 90 top
R10  68.58,30.48 90 top
R11  68.58,34.29 270 top
R12  95.25,76.2 270 top
R13  91.44,68.58 180 top
R14  91.44,64.77 180 top
R16  81.28,73.66 270 top
R17  83.82,73.66 270 top
R18  83.82,81.28 90 top
U1  34.29,87.63 0 top
U2  88.9,77.47 0 top
U$1  90.05,40.05 270 bottom
U$2  105.73,61.23 6 top
U$3  104.91,66.4 12 top
U$4  103.55,71.45 18 top
U$5  101.68,76.34 24 top
U$6  99.3,81 30 top
U$7  96.45,85.39 36 top
U$8  93.16,89.46 42 top
U$9  89.46,93.16 48 top
U$10  85.39,96.45 54 top
U$11  81,99.3 60 top
U$12  76.34,101.68 66 top
U$13  71.45,103.55 72 top
U$14  66.4,104.91 78 top
U$15  61.23,105.73 84 top
U$16  56,106 90 top
U$17  50.77,105.73 96 top
U$18  45.6,104.91 102 top
U$19  40.55,103.55 108 top
U$20  35.66,101.68 114 top
U$21  31,99.3 120 top
U$22  26.61,96.45 126 top
U$23  22.54,93.16 132 top
U$24  18.84,89.46 138 top
U$25  15.55,85.39 144 top
U$26  12.7,81 150 top
U$27  10.32,76.34 156 top
U$28  8.45,71.45 162 top
U$29  7.09,66.4 168 top
U$30  6.27,61.23 174 top
U$31  6,56 180 top
U$32  6.27,50.77 186 top
U$33  7.09,45.6 192 top
U$34  8.45,40.55 198 top
U$35  10.32,35.66 204 top
U$36  12.7,31 210 top
U$37  15.55,26.61 216 top
U$38  18.84,22.54 222 top
U$39  22.54,18.84 228 top
U$40  26.61,15.55 234 top
U$41  31,12.7 240 top
U$42  35.66,10.32 246 top
U$43  40.55,8.45 252 top
U$44  45.6,7.09 258 top
U$45  50.77,6.27 264 top
U$46  56,6 270 top
U$47  61.23,6.27 276 top
U$48  66.4,7.09 282 top
U$49  71.45,8.45 288 top
U$50  76.34,10.32 294 top
U$51  81,12.7 300 top
U$52  85.39,15.55 306 top
U$53  89.46,18.84 312 top
U$54  93.16,22.54 318 top
U$55  96.45,26.61 324 top
U$56  99.3,31 330 top
U$57  101.68,35.66 336 top
U$58  103.55,40.55 342 top
U$59  104.91,45.6 348 top
U$60  105.73,50.77 354 top
U$61  106,56 0 top
U$62  56,56 90 top
X1  99.06,55.88 90 bottom
X2  55.88,12.7 180 bottom

### Tracks (layer width: path | path; a pad name or v marks a point on that pad's centre or on a via)
3,3!KNOFLIK  (2 unrouted)
+3V3  (17 unrouted)
+5V  (15 unrouted)
DS3231/RST  (2 unrouted)
ENC-A  (2 unrouted)
ENC-B  (2 unrouted)
GND  (155 unrouted)
  pour Top (rank 2): -1.27,-1.27 113.03,-1.27 113.03,114.3 -1.27,114.3
INT  (1 unrouted)
LED-SHUTDOWN  (1 unrouted)
MODE-485  (3 unrouted)
MOTOR  (1 unrouted)
N$1  (1 unrouted)
N$2
  pour Top: 104.9,73.28 103.89,72.9 100.46,74.3 101.47,74.8
N$3  (1 unrouted)
N$4
  pour Top: 96.27,86.87 97.16,87.63 93.34,88.01 92.58,87.25
N$5
  pour Top: 106.3,62.61 107.57,62.74 104.39,65.02 103.25,64.77
N$6
  pour Top: 105.41,67.82 106.55,68.07 103.25,69.98 102.11,69.6
N$7
  pour Top: 6.99,38.73 8.13,39.12 11.56,37.59 10.54,37.21
N$8
  pour Top: 98.3,78.87 101.85,77.85 102.87,78.36 99.31,79.5
N$9
  pour Top: 99.31,82.55 100.33,83.06 96.52,83.95 95.63,83.19
N$10
  pour Top: 89.15,90.81 92.84,90.93 93.73,91.69 89.92,91.69
N$11
  pour Top: 89.79,95.5 89.03,94.61 85.34,94.11 85.98,95
N$12
  pour Top: 26.54,13.21 30.35,14.1 30.86,14.99 27.18,14.1
N$13
  pour Top: 76.71,99.44 80.39,100.71 80.9,101.6 77.22,100.46
N$14
  pour Top: 75.95,104.01 75.44,102.87 72.14,101.35 72.39,102.36
N$15
  pour Top: 65.53,107.06 62.36,104.78 62.36,103.63 65.41,106.05
N$16
  pour Top: 57.28,104.01 60.07,106.55 60.2,107.82 57.28,105.28
N$17
  pour Top: 57.28,4.06 59.94,6.99 59.82,8 57.28,5.21
N$18
  pour Top: 49.28,107.57 49.4,106.3 47.24,103.38 46.99,104.39
N$19
  pour Top: 42.42,102.11 44.2,105.41 43.94,106.55 42.04,103.12
N$20
  pour Top: 33.15,98.3 34.16,101.85 33.66,102.87 32.51,99.31
N$21
  pour Top: 28.19,96.52 28.83,95.63 29.46,99.31 28.96,100.33 28.07,96.65
N$22
  pour Top: 87.12,19.43 87.88,18.54 87.63,14.73 87,15.75
N$23
  pour Top: 20.32,93.73 21.08,92.96 21.21,89.15 20.32,89.92
N$24
  pour Top: 16.51,89.79 17.4,89.03 17.91,85.34 17.02,85.98
N$25
  pour Top: 10.41,80.9 11.43,80.26 12.57,76.71 11.56,77.22
N$26
  pour Top: 8.13,75.95 9.02,75.56 10.67,72.14 9.65,72.39 8,75.95
N$27
  pour Top: 104.65,41.53 105.79,41.15 103.89,44.45 102.87,44.7 102.74,44.7
N$28
  pour Top: 4.95,65.66 6.1,65.41 8.26,62.36 7.24,62.36
N$29
  pour Top: 4.19,60.2 5.33,60.07 7.87,57.28 6.86,57.28
N$30
  pour Top: 4.45,49.4 5.59,49.53 8.76,47.24 7.62,46.99
N$31
  pour Top: 5.46,43.94 6.6,44.2 9.91,42.42 8.76,42.04
N$32
  pour Top: 85.47,98.81 84.84,97.79 81.15,97.03 81.66,97.92
N$33
  pour Top: 9.02,33.78 10.16,34.29 13.72,33.02 12.7,32.51
N$34
  pour Top: 11.68,28.96 12.7,29.59 16.38,28.83 15.37,28.07
N$35
  pour Top: 18.29,20.32 19.18,21.08 22.86,21.21 22.1,20.32
N$36
  pour Top: 22.23,16.51 22.99,17.4 26.67,17.91 26.04,16.89
N$37
  pour Top: 70.74,105.79 67.56,103.89 67.31,102.74 70.48,104.78
N$38
  pour Top: 31.11,10.41 31.75,11.43 35.31,12.7 34.8,11.56
N$39
  pour Top: 36.07,8 39.62,9.53 40.01,10.67 36.45,9.02
N$40
  pour Top: 46.48,4.95 49.53,7.24 49.66,8.26 46.74,5.97
N$41
  pour Top: 51.94,4.32 54.74,6.73 54.74,7.87 51.94,5.33
N$42
  pour Top: 52.32,103.89 54.74,106.81 54.74,107.95 52.2,105.03
N$43
  pour Top: 62.74,4.57 65.02,7.62 64.77,8.76 62.61,5.59
N$44
  pour Top: 67.82,6.6 68.07,5.46 69.98,8.89 69.6,9.78
N$45
  pour Top: 78.36,9.14 77.85,10.16 78.87,13.72 79.5,12.7
N$46
  pour Top: 82.55,12.7 83.06,11.68 83.95,15.37 83.19,16.26
N$47
  pour Top: 72.9,8.13 73.28,6.99 74.8,10.54 74.42,11.56
N$48
  pour Top: 90.93,19.05 91.69,18.29 91.69,22.23 90.93,22.86
N$49
  pour Top: 94.61,22.99 95.38,22.23 95,26.04 94.11,26.67
N$50
  pour Top: 100.58,31.75 101.6,31.24 100.33,34.8 99.44,35.18
N$51  (1 unrouted)
  pour Top: 101.35,39.88 103,36.58 104.01,36.2 102.36,39.5
N$52
  pour Top: 24.38,97.28 25.15,96.27 24.77,92.58 24,93.47
N$53
  pour Top: 105.92,46.61 107.06,46.48 104.78,49.53 103.63,49.66
N$54
  pour Top: 106.55,51.94 107.7,51.94 105.16,54.74 104.14,54.74
N$55
  pour Top: 13.21,85.6 14.22,84.84 14.99,81.15 14.1,81.66
N$56
  pour Top: 6.22,70.87 7.37,70.48 9.27,67.31 8.13,67.56
N$58  (1 unrouted)
N$59
  pour Top: 4.06,54.74 5.21,54.74 8,52.2 6.86,52.07
N$60  (1 unrouted)
N$61
  pour Top: 14.73,24.51 15.62,25.15 19.43,24.77 18.54,24
N$62  (1 unrouted)
N$63
  pour Top: 41.15,6.22 44.58,8.26 44.83,9.27 41.53,7.24
N$64
  pour Top: 38.73,105.03 39.12,103.89 37.59,100.46 37.21,101.47
N$65
  pour Top: 98.81,26.54 97.92,27.18 97.03,30.73 97.92,30.23
N$66  (1 unrouted)
N$68  (2 unrouted)
N$69  (1 unrouted)
N$70  (4 unrouted)
N$71  (2 unrouted)
N$72  (3 unrouted)
N$73  (3 unrouted)
N$74  (2 unrouted)
QMC5883-INTERRUPT  (1 unrouted)
RX-485  (1 unrouted)
RX-GPS  (1 unrouted)
SCL  (6 unrouted)
SDA  (6 unrouted)
SQW/INT  (1 unrouted)
SW0  (2 unrouted)
TX-485  (1 unrouted)
TX-GPS  (1 unrouted)
VCC  (123 unrouted)
WS2812  (2 unrouted)
WS2812-5V  (2 unrouted)